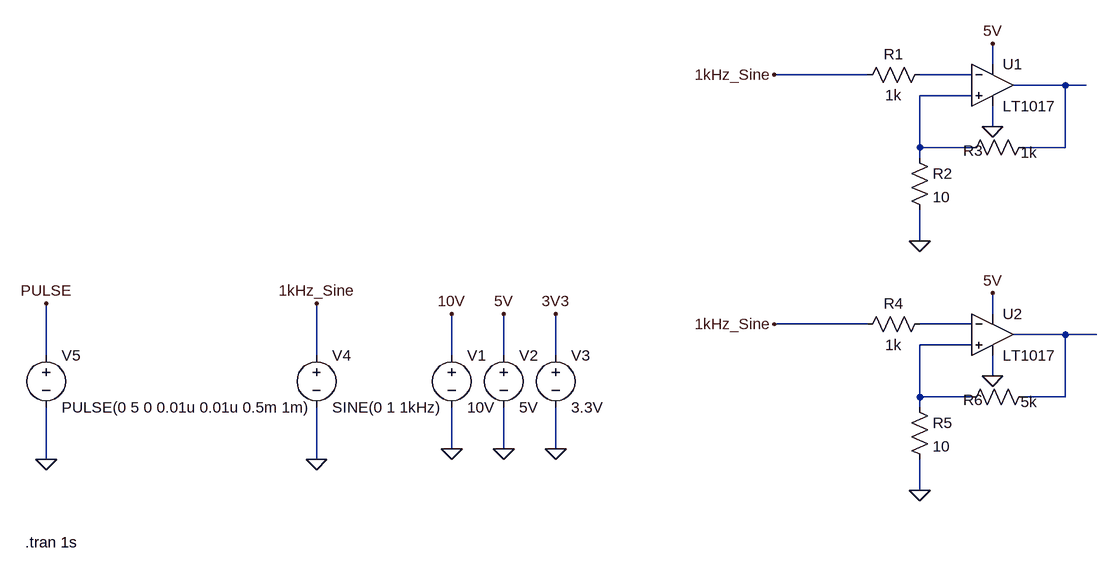
[diagram p0: schematic Schmitt_Debugging.asc]
Schmitt_Debugging.asc, the LTspice schematic file:
Version 4
SHEET 1 880 1416
WIRE 656 -192 656 -224
WIRE 464 -176 320 -176
WIRE 624 -176 544 -176
WIRE 768 -160 688 -160
WIRE 800 -160 768 -160
WIRE 624 -144 544 -144
WIRE 656 -96 656 -128
WIRE 544 -64 544 -144
WIRE 624 -64 544 -64
WIRE 768 -64 768 -160
WIRE 768 -64 704 -64
WIRE 544 -48 544 -64
WIRE 544 80 544 32
WIRE 656 192 656 160
WIRE 464 208 320 208
WIRE 624 208 544 208
WIRE 768 224 688 224
WIRE 816 224 768 224
WIRE 624 240 544 240
WIRE -800 256 -800 176
WIRE -384 256 -384 176
WIRE -176 256 -176 192
WIRE -96 256 -96 192
WIRE -16 256 -16 192
WIRE 656 288 656 256
WIRE 544 320 544 240
WIRE 624 320 544 320
WIRE 768 320 768 224
WIRE 768 320 704 320
WIRE 544 336 544 320
WIRE -176 400 -176 336
WIRE -96 400 -96 336
WIRE -16 400 -16 336
WIRE -800 416 -800 336
WIRE -384 416 -384 336
WIRE 544 464 544 416
FLAG -176 400 0
FLAG -96 400 0
FLAG -16 400 0
FLAG -16 192 3V3
FLAG -96 192 5V
FLAG -176 192 10V
FLAG -384 416 0
FLAG -384 176 1kHz_Sine
FLAG -800 416 0
FLAG -800 176 PULSE
FLAG 656 -224 5V
FLAG 656 -96 0
FLAG 320 -176 1kHz_Sine
FLAG 544 80 0
FLAG 656 160 5V
FLAG 656 288 0
FLAG 320 208 1kHz_Sine
FLAG 544 464 0
SYMBOL voltage -176 240 R0
SYMATTR InstName V1
SYMATTR Value 10V
SYMBOL voltage -96 240 R0
SYMATTR InstName V2
SYMATTR Value 5V
SYMBOL voltage -16 240 R0
SYMATTR InstName V3
SYMATTR Value 3.3V
SYMBOL voltage -384 240 R0
WINDOW 123 0 0 Left 0
WINDOW 39 0 0 Left 0
SYMATTR InstName V4
SYMATTR Value SINE(0 1 1kHz)
SYMBOL voltage -800 240 R0
WINDOW 123 0 0 Left 0
WINDOW 39 0 0 Left 0
SYMATTR InstName V5
SYMATTR Value PULSE(0 5 0 0.01u 0.01u 0.5m 1m)
SYMBOL Comparators\\LT1017 656 -160 R0
SYMATTR InstName U1
SYMBOL res 560 -192 R90
WINDOW 0 0 56 VBottom 2
WINDOW 3 32 56 VTop 2
SYMATTR InstName R1
SYMATTR Value 1k
SYMBOL res 528 -64 R0
SYMATTR InstName R2
SYMATTR Value 10
SYMBOL res 720 -80 R90
WINDOW 0 36 94 VBottom 2
WINDOW 3 8 8 VTop 2
SYMATTR InstName R3
SYMATTR Value 1k
SYMBOL Comparators\\LT1017 656 224 R0
SYMATTR InstName U2
SYMBOL res 560 192 R90
WINDOW 0 0 56 VBottom 2
WINDOW 3 32 56 VTop 2
SYMATTR InstName R4
SYMATTR Value 1k
SYMBOL res 528 320 R0
SYMATTR InstName R5
SYMATTR Value 10
SYMBOL res 720 304 R90
WINDOW 0 36 94 VBottom 2
WINDOW 3 8 8 VTop 2
SYMATTR InstName R6
SYMATTR Value 5k
TEXT -832 544 Left 2 !.tran 1s

The netlist it stands for:
* Schmitt_Debugging.asc
V1 10V 0 10V
V2 5V 0 5V
V3 3V3 0 3.3V
V4 1kHz_Sine 0 SINE(0 1 1kHz)
V5 PULSE 0 PULSE(0 5 0 0.01u 0.01u 0.5m 1m)
XU1 N003 N001 5V 0 N002 LT1017  ; pins In+ In- V+ V- OUT
R1 N001 1kHz_Sine 1k
R2 N003 0 10
R3 N002 N003 1k
XU2 N006 N004 5V 0 N005 LT1017  ; pins In+ In- V+ V- OUT
R4 N004 1kHz_Sine 1k
R5 N006 0 10
R6 N005 N006 5k
.tran 1s
.backanno
.end